# Altium schematic sheet W5500_SCH.SchDoc
size A2
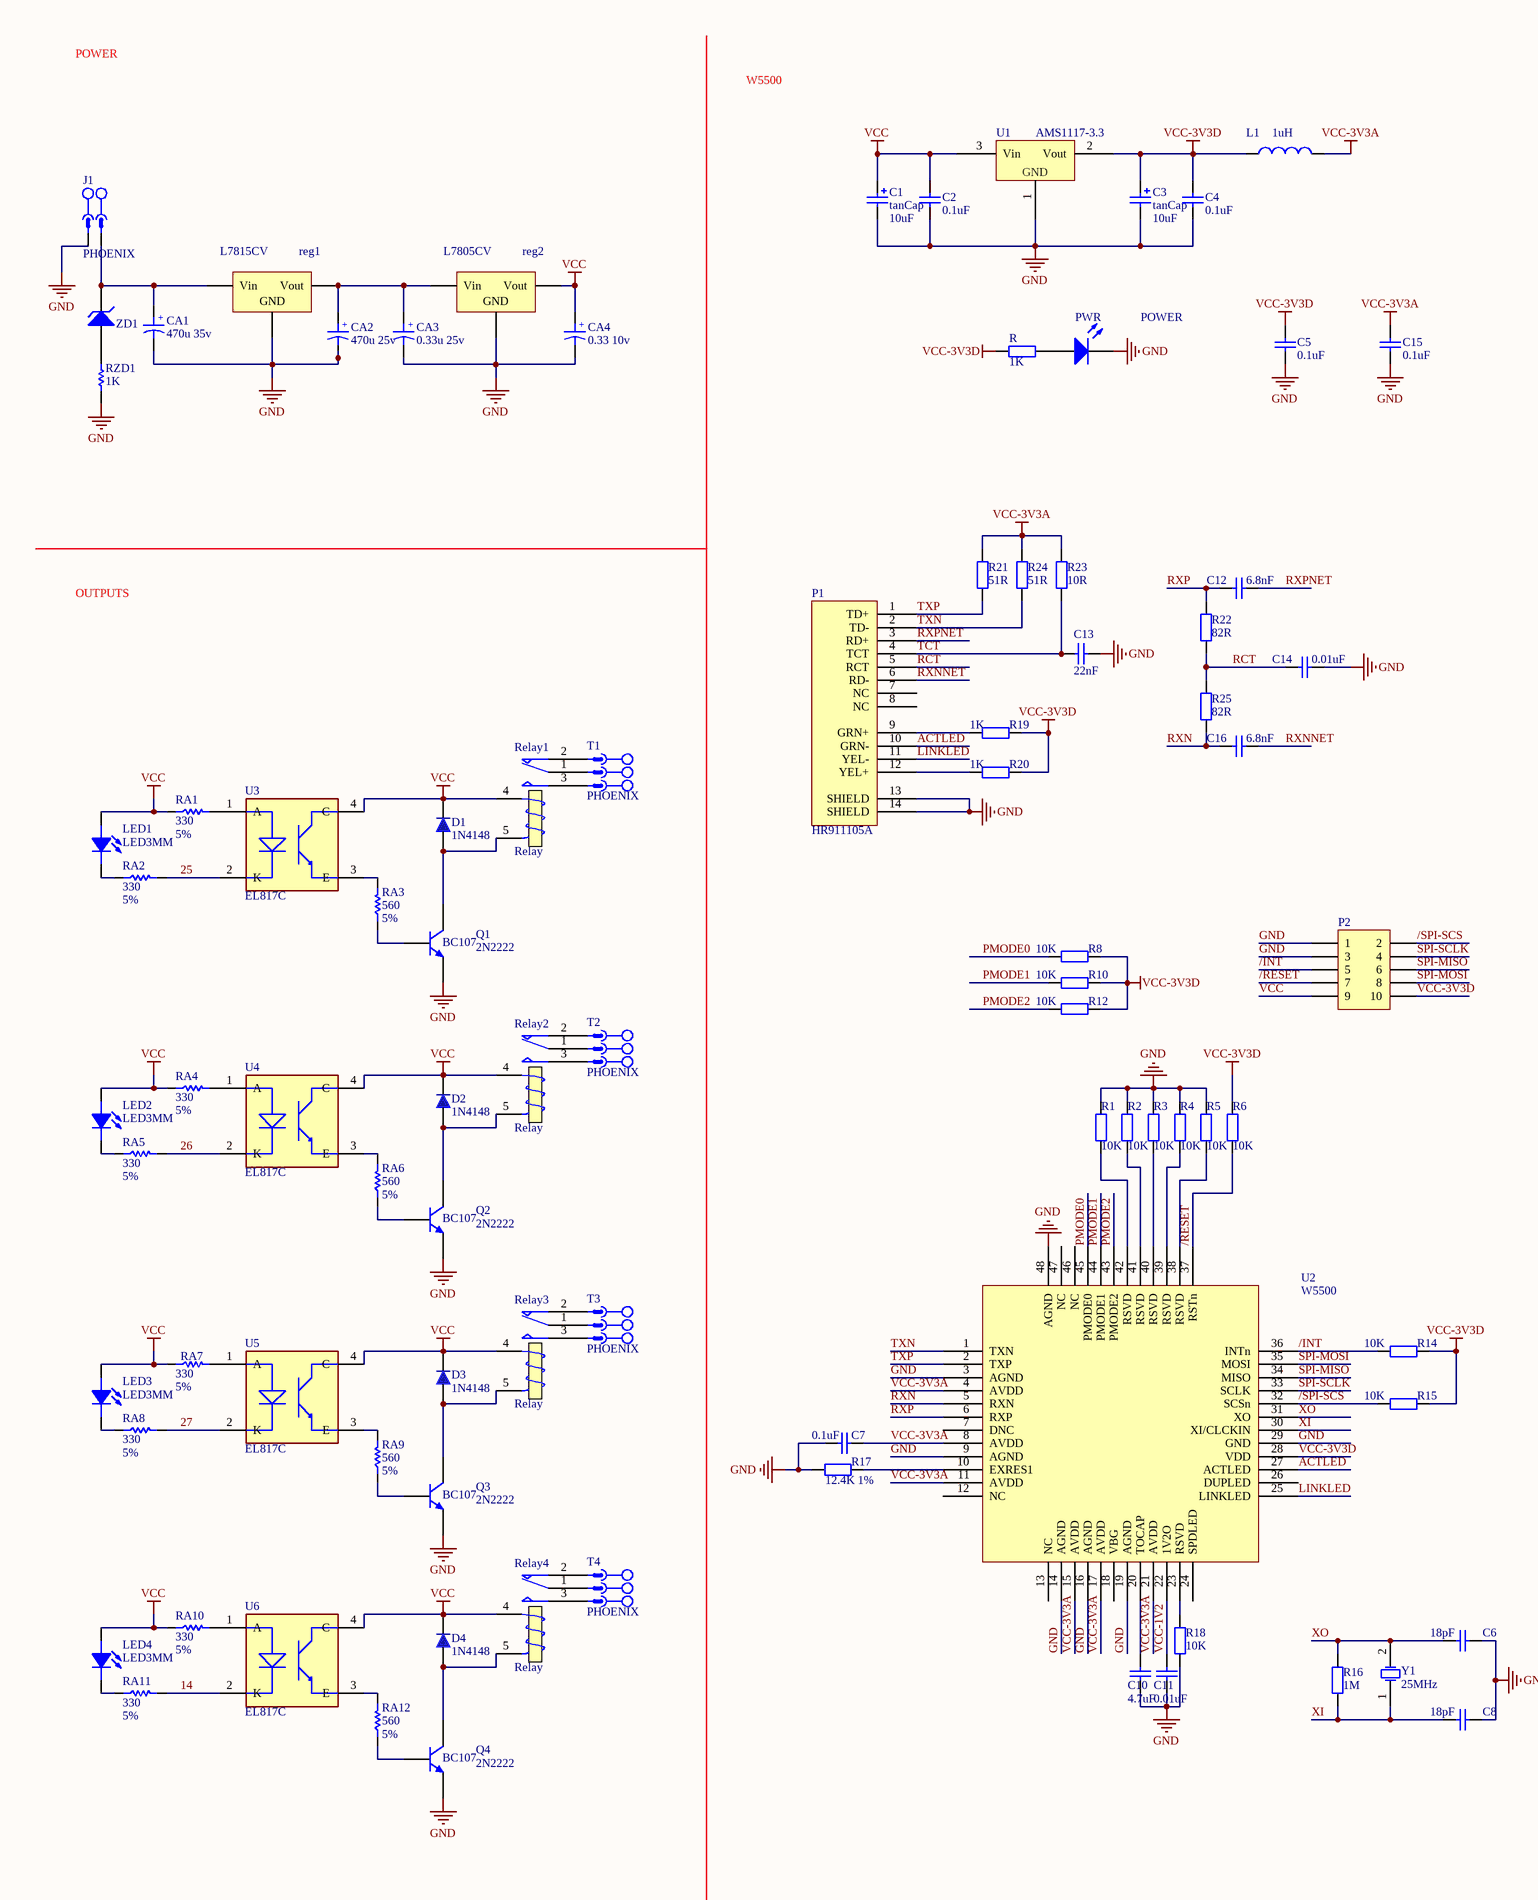
[diagram p0: W5500_SCH.SchDoc, left]
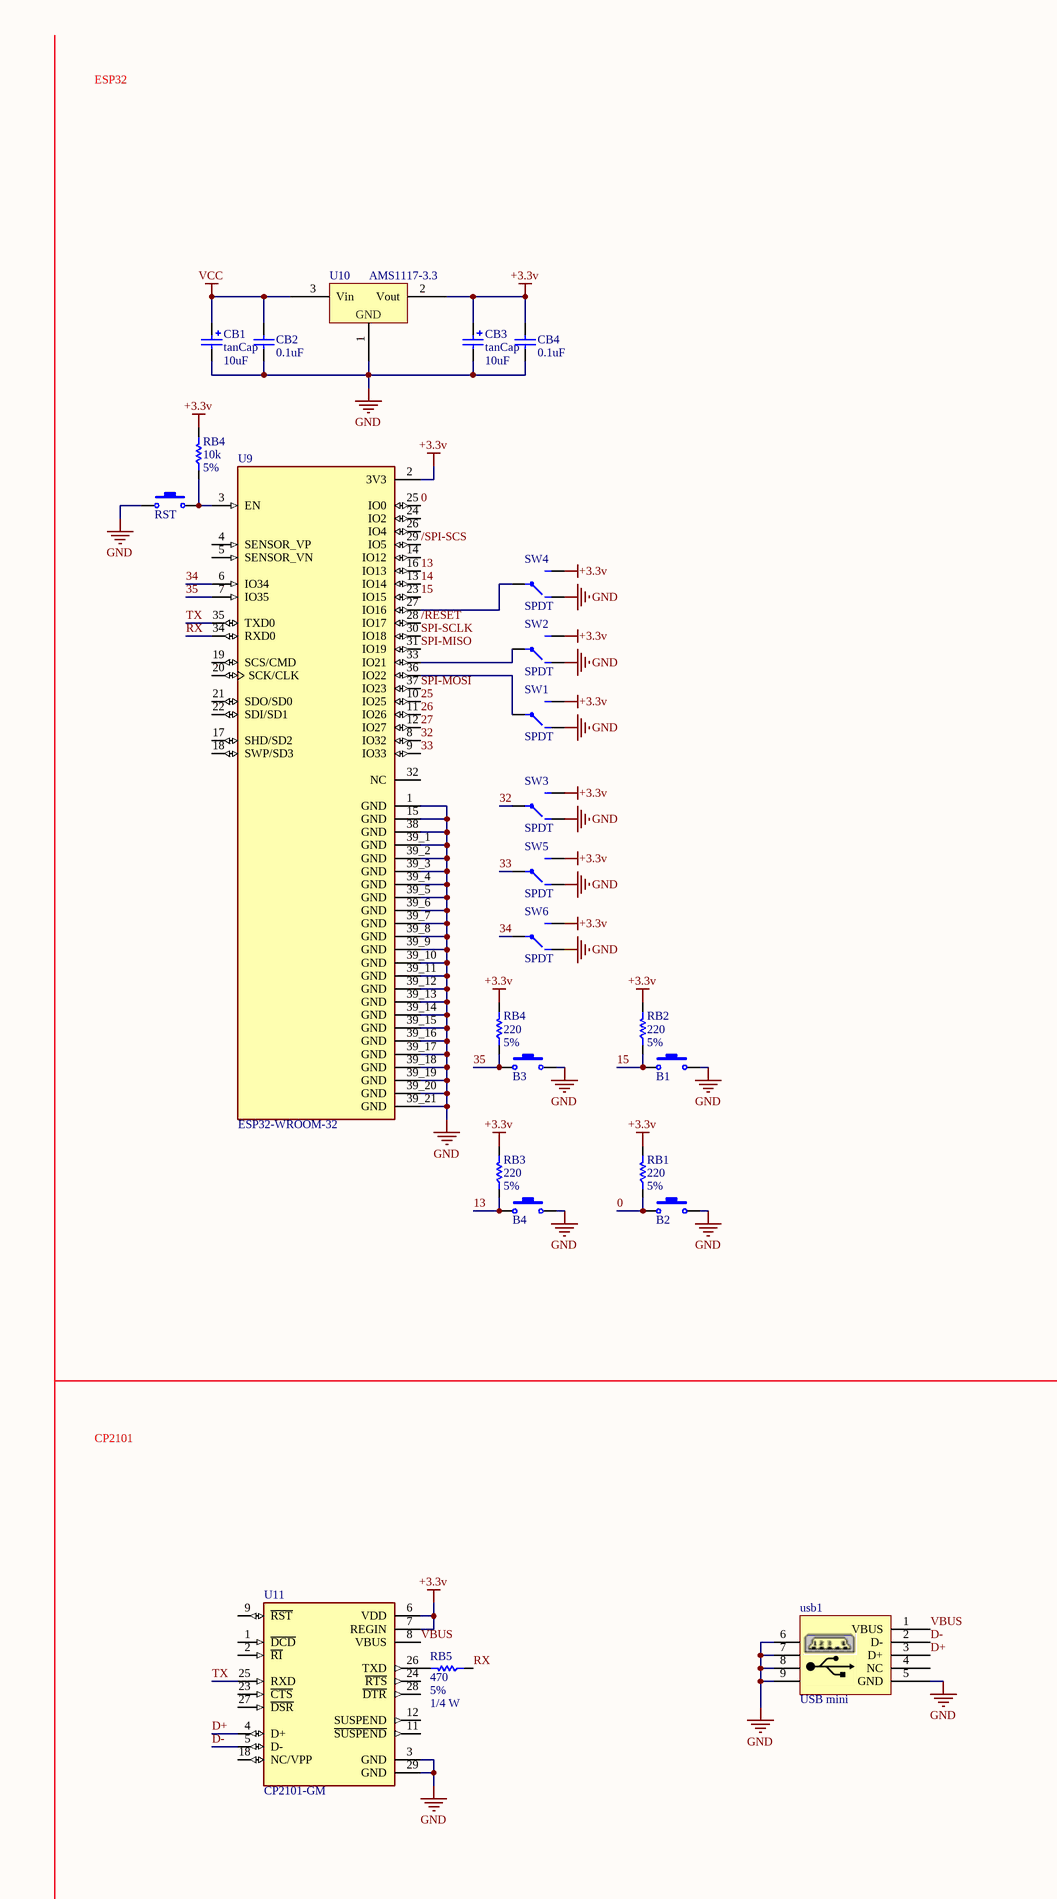
[diagram p1: W5500_SCH.SchDoc, right]

## Parts
(Parts that share a designator on the sheet are numbered #1, #2 ... from top to bottom, then left to right.)
B1  Switch PB  [Switch - Push to On]  (value not drawn)
B2  Switch PB  [Switch - Push to On]  (value not drawn)
B3  Switch PB  [Switch - Push to On]  (value not drawn)
B4  Switch PB  [Switch - Push to On]  (value not drawn)
C1  tanCap  value 10uF  [C1206]
C2  value 0.1uF  [C0805]  (hidden comment: Cap)
C3  tanCap  value 10uF  [C1206]
C4  value 0.1uF  [C0805]  (hidden comment: Cap)
C5  value 0.1uF  [C0805]  (hidden comment: Cap)
C6  value 18pF  [C0805]  (hidden comment: Cap)
C7  value 0.1uF  [C0805]  (hidden comment: Cap)
C8  value 18pF  [C0805]  (hidden comment: Cap)
C10  value 4.7uF  [C0805]  (hidden comment: Cap)
C11  value 0.01uF  [C0805]  (hidden comment: Cap)
C12  value 6.8nF  [C0805]  (hidden comment: Cap)
C13  value 22nF  [C0805]  (hidden comment: Cap)
C14  value 0.01uF  [C0805]  (hidden comment: Cap)
C15  value 0.1uF  [C0805]  (hidden comment: Cap)
C16  value 6.8nF  [C0805]  (hidden comment: Cap)
CA1  470u 35v  [Cap electrolitic radial 6.3x12-2.5]
CA2  470u 25v  [Cap electrolitic radial 6.3x12-2.5]
CA3  0.33u 25v  [Cap electrolitic radial 6.3x12-2.5]
CA4  0.33 10v  [Cap electrolitic radial 6.3x12-2.5]
CB1  tanCap  value 10uF  [C1206]
CB2  value 0.1uF  [RES 1206 (3216X08L)]  (hidden comment: Cap)
CB3  tanCap  value 10uF  [C1206]
CB4  value 0.1uF  [RES 1206 (3216X08L)]  (hidden comment: Cap)
D1  1N4148  [DO 35]
D2  1N4148  [DO 35]
D3  1N4148  [DO 35]
D4  1N4148  [DO 35]
J1  PHOENIX  [MSTBV 2,5/2-G-5]
L1  value 1uH  [C0805]  (hidden comment: Inductor)
LED1  LED3MM  [LED3mm_GRN]
LED2  LED3MM  [LED3mm_GRN]
LED3  LED3MM  [LED3mm_GRN]
LED4  LED3MM  [LED3mm_GRN]
P1  HR911105A  [HR911105A]
P2  (no value)  [HDR2X5]
PWR  POWER  [C0805]
Q1  2N2222  [2N2222]
Q2  2N2222  [2N2222]
Q3  2N2222  [2N2222]
Q4  2N2222  [2N2222]
R  value 1K  [C0805]  (hidden comment: Res2)
R1  value 10K  [C0805]  (hidden comment: Res2)
R2  value 10K  [C0805]  (hidden comment: Res2)
R3  value 10K  [C0805]  (hidden comment: Res2)
R4  value 10K  [C0805]  (hidden comment: Res2)
R5  value 10K  [C0805]  (hidden comment: Res2)
R6  value 10K  [C0805]  (hidden comment: Res2)
R8  value 10K  [C0805]  (hidden comment: Res2)
R10  value 10K  [C0805]  (hidden comment: Res2)
R12  value 10K  [C0805]  (hidden comment: Res2)
R14  value 10K  [C0805]  (hidden comment: Res2)
R15  value 10K  [C0805]  (hidden comment: Res2)
R16  value 1M  [C0805]  (hidden comment: Res2)
R17  value 12.4K 1%  [C0805]  (hidden comment: Res2)
R18  value 10K  [C0805]  (hidden comment: Res2)
R19  value 1K  [C0805]  (hidden comment: Res2)
R20  value 1K  [C0805]  (hidden comment: Res2)
R21  value 51R  [C0805]  (hidden comment: Res2)
R22  value 82R  [C0805]  (hidden comment: Res2)
R23  value 10R  [C0805]  (hidden comment: Res2)
R24  value 51R  [C0805]  (hidden comment: Res2)
R25  value 82R  [C0805]  (hidden comment: Res2)
RA1  Tolerance: 5%  [RES 1206 (3216X08L)]  (hidden comment: 330)
RA2  Tolerance: 5%  [RES 1206 (3216X08L)]  (hidden comment: 330)
RA3  Tolerance: 5%  [RES 1206 (3216X08L)]  (hidden comment: 560)
RA4  Tolerance: 5%  [RES 1206 (3216X08L)]  (hidden comment: 330)
RA5  Tolerance: 5%  [RES 1206 (3216X08L)]  (hidden comment: 330)
RA6  Tolerance: 5%  [RES 1206 (3216X08L)]  (hidden comment: 560)
RA7  Tolerance: 5%  [RES 1206 (3216X08L)]  (hidden comment: 330)
RA8  Tolerance: 5%  [RES 1206 (3216X08L)]  (hidden comment: 330)
RA9  Tolerance: 5%  [RES 1206 (3216X08L)]  (hidden comment: 560)
RA10  Tolerance: 5%  [RES 1206 (3216X08L)]  (hidden comment: 330)
RA11  Tolerance: 5%  [RES 1206 (3216X08L)]  (hidden comment: 330)
RA12  Tolerance: 5%  [RES 1206 (3216X08L)]  (hidden comment: 560)
RB1  Tolerance: 5%  [RES 1206 (3216X08L)]  (hidden comment: 220)
RB2  Tolerance: 5%  [RES 1206 (3216X08L)]  (hidden comment: 220)
RB3  Tolerance: 5%  [RES 1206 (3216X08L)]  (hidden comment: 220)
RB4#1  Tolerance: 5%  [RES 1206 (3216X08L)]  (hidden comment: 10k)
RB4#2  Tolerance: 5%  [RES 1206 (3216X08L)]  (hidden comment: 220)
RB5  Tolerance: 5%  Power: 1/4 W  [RES 1206 (3216X08L)]  (hidden comment: 470)
reg1  L7815CV  [TO-220 AB WITH HEAT SINK]
reg2  L7805CV  [TO-220 AB WITH HEAT SINK]
Relay1  Relay  [Relay 18.85x15.35x15.70]
Relay2  Relay  [Relay 18.85x15.35x15.70]
Relay3  Relay  [Relay 18.85x15.35x15.70]
Relay4  Relay  [Relay 18.85x15.35x15.70]
RST  Switch PB  [Switch - Push to On]  (value not drawn)
RZD1  1K  [RES-(1/4)]
SW1  SPDT  [Switch SPDT - 500x270x1100x185 mil]
SW2  SPDT  [Switch SPDT - 500x270x1100x185 mil]
SW3  SPDT  [Switch SPDT - 500x270x1100x185 mil]
SW4  SPDT  [Switch SPDT - 500x270x1100x185 mil]
SW5  SPDT  [Switch SPDT - 500x270x1100x185 mil]
SW6  SPDT  [Switch SPDT - 500x270x1100x185 mil]
T1  PHOENIX  [MSTBV 2,5/3-G-5]
T2  PHOENIX  [MSTBV 2,5/3-G-5]
T3  PHOENIX  [MSTBV 2,5/3-G-5]
T4  PHOENIX  [MSTBV 2,5/3-G-5]
U1  AMS1117-3.3  [SOT223_M]
U2  W5500  [LQFP48]
U3  EL817C  [DIP762W25P254L650H453Q4B]
U4  EL817C  [DIP762W25P254L650H453Q4B]
U5  EL817C  [DIP762W25P254L650H453Q4B]
U6  EL817C  [DIP762W25P254L650H453Q4B]
U9  ESP32-WROOM-32  [MODULE_ESP32-WROOM-32]
U10  AMS1117-3.3  [SOT223_M]
U11  CP2101-GM  [QFN50P500X500X100-29N]
usb1  USB mini  [mini USB Connector]
Y1  25MHz  [XTAL-HC49]
ZD1  Diode Zener  [Diode 1W]  (value not drawn)

## Nets
+3.3v: CB3.1 CB4.1 RB1.2 RB2.2 RB3.2 RB4#1.2 RB4#2.2 SW1.1 SW2.1 SW3.1 SW4.1 SW5.1 SW6.1 U9.2(3V3) U10.2(Vout) U11.6(VDD) U11.7(REGIN)
GND: B1.2 B2.2 B3.2 B4.2 C1.2 C2.2 C3.2 C4.2 C5.2 C6.1 C7.2 C8.1 C10.2 C11.2 C13.2 C14.1 C15.1 CA1.2 CA2.2 CA3.2 CA4.2 CB1.2 CB2.2 CB3.2 CB4.2 J1.1 P1.13(SHIELD) P1.14(SHIELD) P2.1 P2.3 PWR.2(K) Q1.1(E) Q2.1(E) Q3.1(E) Q4.1(E) R1.2 R2.2 R3.2 R4.2 R5.2 R17.1 R18.1 reg1.2(GND) reg2.2(GND) RST.2 RZD1.1 SW1.3 SW2.3 SW3.3 SW4.3 SW5.3 SW6.3 U1.1(GND) U2.3(AGND) U2.9(AGND) U2.14(AGND) U2.16(AGND) U2.19(AGND) U2.29(GND) U2.48(AGND) U9.1(GND) U9.15(GND) U9.38(GND) U9.39_1(GND) U9.39_2(GND) U9.39_3(GND) U9.39_4(GND) U9.39_5(GND) U9.39_6(GND) U9.39_7(GND) U9.39_8(GND) U9.39_9(GND) U9.39_10(GND) U9.39_11(GND) U9.39_12(GND) U9.39_13(GND) U9.39_14(GND) U9.39_15(GND) U9.39_16(GND) U9.39_17(GND) U9.39_18(GND) U9.39_19(GND) U9.39_20(GND) U9.39_21(GND) U10.1(GND) U11.3(GND) U11.29(GND) usb1.5(GND) usb1.6 usb1.7 usb1.8 usb1.9
VCC: C1.1 C2.1 CA4.1 CB1.1 CB2.1 D1.2 D2.2 D3.2 D4.2 LED1.1(ANODE) LED2.1(ANODE) LED3.1(ANODE) LED4.1(ANODE) P2.9 RA1.1 RA4.1 RA7.1 RA10.1 reg2.3(Vout) Relay1.4(T1) Relay2.4(T1) Relay3.4(T1) Relay4.4(T1) U1.3(Vin) U3.4(C) U4.4(C) U5.4(C) U6.4(C) U10.3(Vin)
VCC-3V3A: C7.1 C15.2 L1.2 R21.1 R23.1 R24.1 U2.4(AVDD) U2.8(AVDD) U2.11(AVDD) U2.15(AVDD) U2.17(AVDD) U2.21(AVDD)
VCC-3V3D: C3.1 C4.1 C5.1 L1.1 P2.10 R.2 R6.2 R8.2 R10.2 R12.2 R14.2 R15.2 R19.1 R20.1 U1.2(Vout) U2.28(VDD)
0: B2.1 RB1.1 U9.25(IO0)
13: B4.1 RB3.1 U9.16(IO13)
14: RA11.2 U6.2(K) U9.13(IO14)
15: B1.1 RB2.1 U9.23(IO15)
25: RA2.2 U3.2(K) U9.10(IO25)
26: RA5.2 U4.2(K) U9.11(IO26)
27: RA8.2 U5.2(K) U9.12(IO27)
32: SW3.2 U9.8(IO32)
33: SW5.2 U9.9(IO33)
34: SW6.2 U9.6(IO34)
35: B3.1 RB4#2.1 U9.7(IO35)
/INT: P2.5 R14.1 U2.36(INTn)
/RESET: P2.7 R6.1 U2.37(RSTn) U9.28(IO17)
/SPI-SCS: P2.2 R15.1 U2.32(SCSn) U9.29(IO5)
ACTLED: P1.10(GRN-) U2.27(ACTLED)
D+: U11.4(D+) usb1.3(D+)
D-: U11.5(D-) usb1.2(D-)
LINKLED: P1.11(YEL-) U2.25(LINKLED)
PMODE0: R8.1 U2.45(PMODE0)
PMODE1: R10.1 U2.44(PMODE1)
PMODE2: R12.1 U2.43(PMODE2)
RCT: C14.2 P1.5(RCT) R22.1 R25.2
RX: RB5.1 U9.34(RXD0)
RXN: C16.2 R25.1 U2.5(RXN)
RXNNET: C16.1 P1.6(RD-)
RXP: C12.2 R22.2 U2.6(RXP)
RXPNET: C12.1 P1.3(RD+)
SPI-MISO: P2.6 U2.34(MISO) U9.31(IO19)
SPI-MOSI: P2.8 U2.35(MOSI) U9.37(IO23)
SPI-SCLK: P2.4 U2.33(SCLK) U9.30(IO18)
TCT: C13.1 P1.4(TCT) R23.2
TX: U9.35(TXD0) U11.25(RXD)
TXN: P1.2(TD-) R24.2 U2.1(TXN)
TXP: P1.1(TD+) R21.2 U2.2(TXP)
VBUS: U11.8(VBUS) usb1.1(VBUS)
VCC-1V2: C11.1 U2.22(1V2O)
XI: C8.2 R16.1 U2.30(XI/CLCKIN) Y1.1(OSC1)
XO: C6.2 R16.2 U2.31(XO) Y1.2(OSC2)
NetC10_1: C10.1 U2.20(TOCAP)
NetCA1_1: CA1.1 J1.2 reg1.1(Vin) ZD1.2(K)
NetCA2_1: CA2.1 CA3.1 reg1.3(Vout) reg2.1(Vin)
NetD1_1: D1.1 Q1.3(C) Relay1.5(T2)
NetD2_1: D2.1 Q2.3(C) Relay2.5(T2)
NetD3_1: D3.1 Q3.3(C) Relay3.5(T2)
NetD4_1: D4.1 Q4.3(C) Relay4.5(T2)
NetLED1_2: LED1.2(CATHODE) RA2.1
NetLED2_2: LED2.2(CATHODE) RA5.1
NetLED3_2: LED3.2(CATHODE) RA8.1
NetLED4_2: LED4.2(CATHODE) RA11.1
NetP1_9: P1.9(GRN+) R19.2
NetP1_12: P1.12(YEL+) R20.2
NetPWR_1: PWR.1(A) R.1
NetQ1_2: Q1.2(B) RA3.1
NetQ2_2: Q2.2(B) RA6.1
NetQ3_2: Q3.2(B) RA9.1
NetQ4_2: Q4.2(B) RA12.1
NetR1_1: R1.1 U2.42(RSVD)
NetR2_1: R2.1 U2.41(RSVD)
NetR3_1: R3.1 U2.40(RSVD)
NetR4_1: R4.1 U2.39(RSVD)
NetR5_1: R5.1 U2.38(RSVD)
NetR17_2: R17.2 U2.10(EXRES1)
NetR18_2: R18.2 U2.23(RSVD)
NetRA1_2: RA1.2 U3.1(A)
NetRA3_2: RA3.2 U3.3(E)
NetRA4_2: RA4.2 U4.1(A)
NetRA6_2: RA6.2 U4.3(E)
NetRA7_2: RA7.2 U5.1(A)
NetRA9_2: RA9.2 U5.3(E)
NetRA10_2: RA10.2 U6.1(A)
NetRA12_2: RA12.2 U6.3(E)
NetRB4#1_1: RB4#1.1 RST.1 U9.3(EN)
NetRB5_2: RB5.2 U11.26(TXD)
NetRelay1_1: Relay1.1(COM) T1.2
NetRelay1_2: Relay1.2(NC) T1.1
NetRelay1_3: Relay1.3(NO) T1.3
NetRelay2_1: Relay2.1(COM) T2.2
NetRelay2_2: Relay2.2(NC) T2.1
NetRelay2_3: Relay2.3(NO) T2.3
NetRelay3_1: Relay3.1(COM) T3.2
NetRelay3_2: Relay3.2(NC) T3.1
NetRelay3_3: Relay3.3(NO) T3.3
NetRelay4_1: Relay4.1(COM) T4.2
NetRelay4_2: Relay4.2(NC) T4.1
NetRelay4_3: Relay4.3(NO) T4.3
NetRZD1_2: RZD1.2 ZD1.1(A)
NetSW1_2: SW1.2 U9.36(IO22)
NetSW2_2: SW2.2 U9.33(IO21)
NetSW4_2: SW4.2 U9.27(IO16)

Not connected (* = marked no-connect by the designer): P1 7(NC) 8(NC); U2 7(DNC) 12(NC) 13(NC) 18(VBG) 24(SPDLED) 26(DUPLED) 46(NC) 47(NC); U9 4(SENSOR_VP) 5(SENSOR_VN) 14(IO12) 17(SHD/SD2) 18(SWP/SD3) 19(SCS/CMD) 20(SCK/CLK) 21(SDO/SD0) 22(SDI/SD1) 24(IO2) 26(IO4) 32(NC); U11 1(~{DCD}) 2(~{RI}) 9(~{RST}) 11(~{SUSPEND}) 12(SUSPEND) 18(NC/VPP) 23(~{CTS}) 24(~{RTS}) 27(~{DSR}) 28(~{DTR}); usb1 4(NC)

## Notes on the sheet
- POWER
- W5500
- ESP32
- OUTPUTS
- CP2101
- (in symbol 2N2222) BC107
- (in symbol Cap ELECTROLITIC TOTAL SIZE) +

## Library data of the parts
B1-B4 RST = Switch PB: Push Button Switch
C1 C3 CB1 CB3 = Cap Pol2: Polarized Capacitor (Axial); Published: 8-Jun-2000; LatestRevisionDate: 17-Jul-2002; LatestRevisionNote: Re-released for DXP Platform.; PackageReference: POLAR0.8; Publisher: Altium Limited; PackageDescription: Polarized Capacitor; 2 Leads
C2 C4-C8 C10-C16 CB2 CB4 = Cap: Capacitor; Published: 8-Jun-2000; LatestRevisionDate: 17-Jul-2002; LatestRevisionNote: Re-released for DXP Platform.; PackageReference: RAD-0.3; Publisher: Altium Limited; PackageDescription: Radial Cap, Thru-Hole; 2 Leads; 0.3 in Pin Spacing
CA1-CA4 = Cap ELECTROLITIC TOTAL SIZE: Cap electrolitic radial; Designer: Abbas Basereh; VALUE: 1uF; Data: 16-12-2016; Part. No: *
D1-D4 = 1N4148: DIODE GEN PURP 100V 200MA DO35; Published: 2017-1-12; PackageVersion: 2017-1-12; PackageReference: DO 35; Publisher: Abbas Basereh; PackageDescription: DIODE GEN PURP 100V 200MA DO35; ComponentLink1Description: Manufacturer Link; ComponentLink1URL: http://www.digikey.com/product-detail/en/fairchild-on-semiconductor/1N4148/1N4148FS-ND/458603; ComponentLink2Description: Datasheet; PART.NO: 1N4148
J1 = CON_Phoenix_MSTBV_02: 2 Pitch: 5 mm Color: green Contact surface: Tin Assembly; Manufacturer: PHOENIX CONTACT; Connector type: PCB Terminal Block; designer: ABBAS BASEREH; Max Current: 12 A; Positions: 2; Voltage: 320 V; Category: Connector; ComponentLink1Description: Header, Nominal current: 12 A Rated voltage (III/2): 320 V Number of positions: 2 Pitch: 5 mm Color: green Contact surface: Tin Assembly: Soldering  DESIGNER:ABBAS BASEREH; ComponentLink2Description: Reference; Mounting Technology: Through-Hole; Pin Count: 2; Revision 1: 2017-3-1; Status: Unreleased; PART.NO: PHOENIX
L1 = Inductor: Code_IEC: 1005; Published: 8-Jun-2000; LatestRevisionDate: 29-May-2009; LatestRevisionNote: IPC-7351 Footprint Added.; PackageReference: 0402-A; Publisher: Altium Limited; PackageDescription: Chip Inductor; Code_JEITA: 0402
LED1-LED4 = LED 3MM: Light Emitting Diode; Designer: Ali Hafizi
P2 = Header 5X2: LatestRevisionDate: 17-Jul-2002; LatestRevisionNote: Re-released for DXP Platform.; Publisher: Altium Limited
PWR = LED0: Typical INFRARED GaAs LED; Published: 8-Jun-2000; LatestRevisionDate: 08-Jul-2005; LatestRevisionNote: Mech Layer 1 removed.; PackageReference: LED-0; Publisher: Altium Limited; PackageDescription: LED; 2 Leads
Q1-Q4 = 2N2222: NPN Transistor
R R1-R6 R8 R10 R12 R14-R25 = Res2: Resistor; Published: 8-Jun-2000; LatestRevisionDate: 17-Jul-2002; LatestRevisionNote: Re-released for DXP Platform.; PackageReference: AXIAL-0.4; Publisher: Altium Limited; PackageDescription: Axial Device, Thru-Hole; 2 Leads; 0.4 in Pin Spacing
RA1-RA12 RB1-RB3 RB4#1 RB4#2 RB5 = Resistor
  RA1 RA2 RA4 RA5 RA7 RA8 RA10 RA11: Value: 330
  RA3 RA6 RA9 RA12: Value: 560
  RB1-RB3 RB4#2: Value: 220
  RB4#1: Value: 10k
  RB5: Value: 470
reg1 reg2 = L7805CV-Linear Voltage Regulator IC Positive 1 Output 5V 1.5A TO-220AB: Linear Voltage Regulator IC Positive FIXED; Manufacturer: STMicroelectronics; Designer: Abbas Basereh; Link: https://www.aliexpress.com/item/; Link: http://www.tme.eu/en/; Link: http://www.digikey.com/; Part. No: L7805CV
Relay1-Relay4 = Relay: SPDT Relay; Designer: Eng. Saeid Jorablo; Company: E.P.I.L; Design_Date: 2011/10/31
RZD1 = RES DIP PACKAGE: TOTAL DIP RESISTOR PACK; Designer: Ali Hafizi
SW1-SW6 = Switch SPDT: SPDT Switch; Designer: Saeid Jorablo; Company: ControTEK; Adding Date: 1387/01/10
T1-T4 = CON_Phoenix_MSTBV_03: 3 Pitch: 5 mm Color: green Contact surface: Tin Assembly; Manufacturer: PHOENIX CONTACT; Connector type: PCB Terminal Block; designer: ABBAS BASEREH; Max Current: 12 A; Positions: 3; Voltage: 320 V; Category: Connector; ComponentLink1Description: Header, Nominal current: 12 A Rated voltage (III/2): 320 V Number of positions: 3 Pitch: 5 mm Color: green Contact surface: Tin Assembly: Soldering  DESIGNER:ABBAS BASEREH; ComponentLink2Description: Reference; Mounting Technology: Through-Hole; Pin Count: 3; Revision 1: 2017-3-1; Status: Unreleased; PART.NO: PHOENIX
U1 U10 = AMS1117: AMS1117-
U3-U6 = EL817C: Optoisolator Transistor Output 5000Vrms 1 Channel 4-DIP; MF: Everlight Electronics; Price: None; Value: *; Package: SMD-4 Everlight; SnapEDA_Link: https://www.snapeda.com/parts/EL817C/Everlight%20Electronics%20Co%20Ltd/view-part/548216/?ref=snap; Availability: Unavailable; MP: EL817C
U9 = ESP32-WROOM-32: Bluetooth, WiFi 802.11b/g/n, Bluetooth v4.2 +EDR, Class 1, 2 and 3 Transceiver Module 2.4GHz ~ 2.5GHz Antenna Not Included, U.FL Surface Mount; MF: Espressif Systems; MP: ESP32-WROOM-32; Purchase-URL: https://pricing.snapeda.com/search/part/ESP32-WROOM-32/?ref=eda; Package: Module Espressif Systems; Value: *; Digi-Key_Part_Number: 1965-ESP32-WROOM-32U-N4CT-ND; Check_prices: https://www.snapeda.com/parts/ESP32-WROOM-32/Espressif+Systems/view-part/?ref=eda; SnapEDA_Link: https://www.snapeda.com/parts/ESP32-WROOM-32/Espressif+Systems/view-part/?ref=snap
U11 = CP2102-GM: USB Bridge, USB to UART USB 2.0 UART Interface 28-QFN _5x5_; MF: Silicon Labs; Package: QFN-28 Silicon Labs; Value: *; Price: None; MP: CP2102-GM; Availability: Unavailable; SnapEDA_Link: https://www.snapeda.com/parts/CP2102-GM/Silicon%20Labs/view-part/135876/?ref=snap
usb1 = USB mini: mini USB Connector
Y1 = XTAL: Crystal Oscillator; Published: 8-Jun-2000; LatestRevisionDate: 17-Jul-2002; LatestRevisionNote: Re-released for DXP Platform.; PackageReference: R38; Publisher: Altium Limited; PackageDescription: Crystal, Thru-Hole; 2 Leads; Body 3.1 x 8.2 mm (Dia.xH)
ZD1 = Diode Zener: Zener Diode; Designer: Saeid Jorablo; Company: E.P.I.L; Voltage: 3.3 V; Design Date: 2011/11/02